# Altium schematic sheet SIX_OUTPORT-V2.SchDoc
size A3
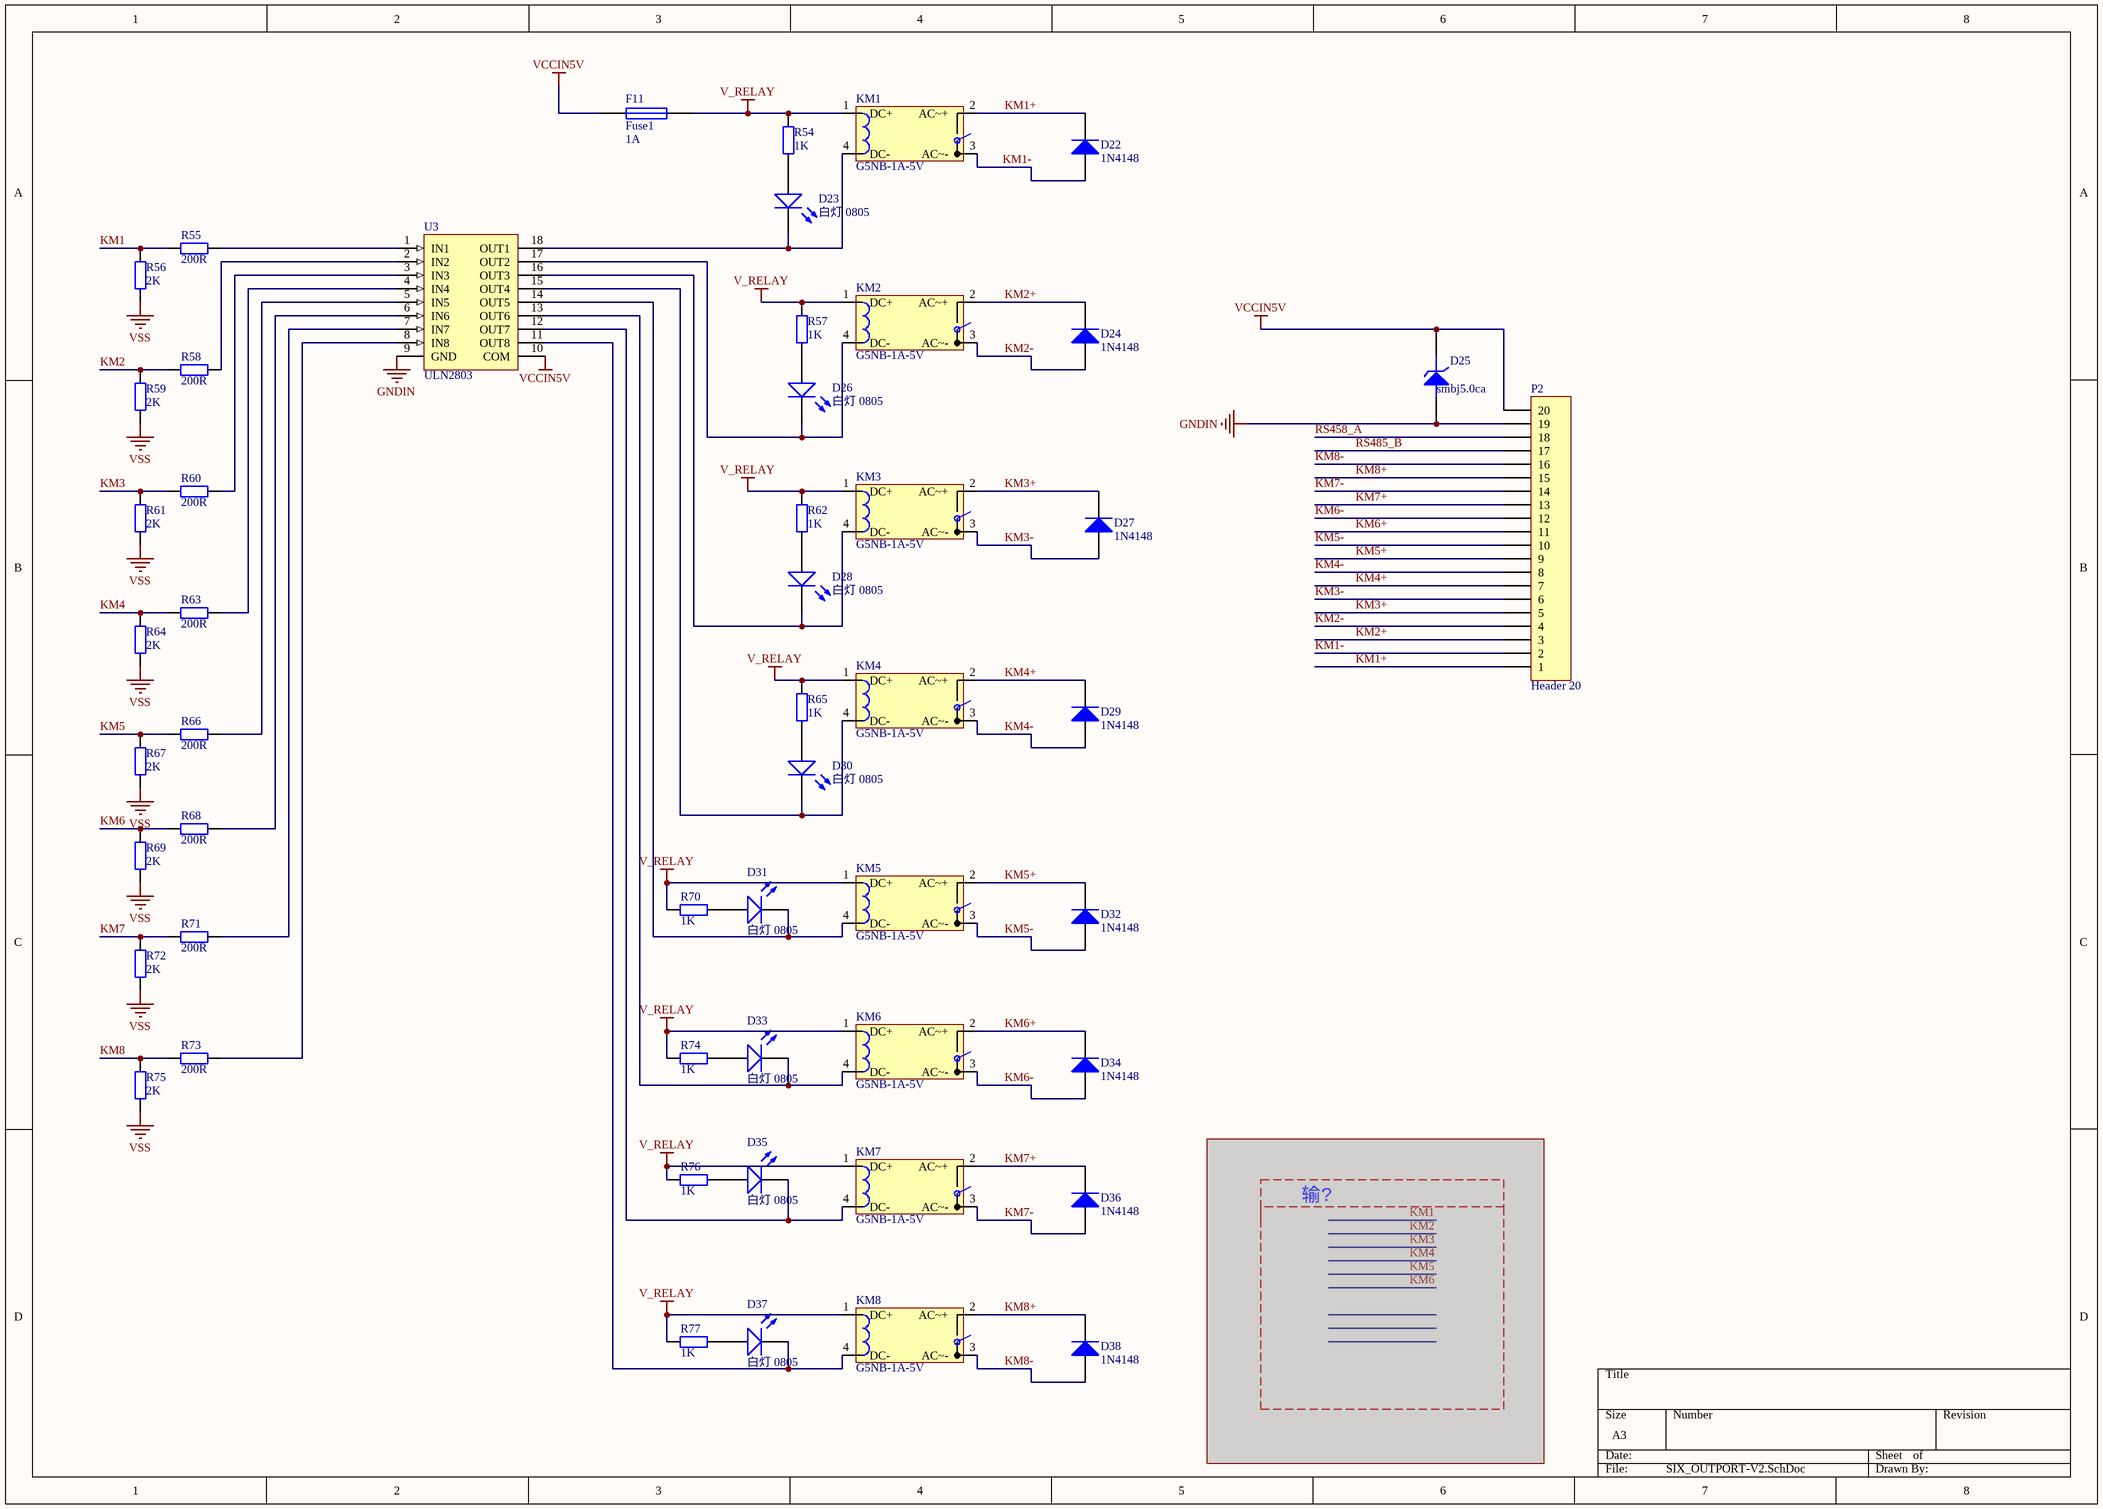
[diagram p0: SIX_OUTPORT-V2.SchDoc]

## Parts
D22  1N4148  [LC-LL-34]
D23  白灯 0805  [LC-0603_LED_S1]
D24  1N4148  [LC-LL-34]
D25  smbj5.0ca  [LC-SMB(DO-214AA)_S1]
D26  白灯 0805  [LC-0603_LED_S1]
D27  1N4148  [LC-LL-34]
D28  白灯 0805  [LC-0603_LED_S1]
D29  1N4148  [LC-LL-34]
D30  白灯 0805  [LC-0603_LED_S1]
D31  白灯 0805  [LC-0603_LED_S1]
D32  1N4148  [LC-LL-34]
D33  白灯 0805  [LC-0603_LED_S1]
D34  1N4148  [LC-LL-34]
D35  白灯 0805  [LC-0603_LED_S1]
D36  1N4148  [LC-LL-34]
D37  白灯 0805  [LC-0603_LED_S1]
D38  1N4148  [LC-LL-34]
F11  Fuse1  value 1A  [LC-1206_R]
KM1  G5NB-1A-5V  [G5NB-1A-5V]
KM2  G5NB-1A-5V  [G5NB-1A-5V]
KM3  G5NB-1A-5V  [G5NB-1A-5V]
KM4  G5NB-1A-5V  [G5NB-1A-5V]
KM5  G5NB-1A-5V  [G5NB-1A-5V]
KM6  G5NB-1A-5V  [G5NB-1A-5V]
KM7  G5NB-1A-5V  [G5NB-1A-5V]
KM8  G5NB-1A-5V  [G5NB-1A-5V]
P2  Header 20  [HDR_5.0_20P]
R54  1K  [LC-0603_R]
R55  200R  [LC-0603_R]
R56  2K  [LC-0603_R]
R57  1K  [LC-0603_R]
R58  200R  [LC-0603_R]
R59  2K  [LC-0603_R]
R60  200R  [LC-0603_R]
R61  2K  [LC-0603_R]
R62  1K  [LC-0603_R]
R63  200R  [LC-0603_R]
R64  2K  [LC-0603_R]
R65  1K  [LC-0603_R]
R66  200R  [LC-0603_R]
R67  2K  [LC-0603_R]
R68  200R  [LC-0603_R]
R69  2K  [LC-0603_R]
R70  1K  [LC-0603_R]
R71  200R  [LC-0603_R]
R72  2K  [LC-0603_R]
R73  200R  [LC-0603_R]
R74  1K  [LC-0603_R]
R75  2K  [LC-0603_R]
R76  1K  [LC-0603_R]
R77  1K  [LC-0603_R]
U3  ULN2803  [LC-SOIC-18_300mil]

## Nets
GNDIN: D25.1(A) P2.19 U3.9(GND)
V_RELAY: F11.2 KM1.1(DC+) KM2.1(DC+) KM3.1(DC+) KM4.1(DC+) KM5.1(DC+) KM6.1(DC+) KM7.1(DC+) KM8.1(DC+) R54.1 R57.1 R62.1 R65.1 R70.1 R74.1 R76.1 R77.1
VCCIN5V: D25.2(K) F11.1 P2.20 U3.10(COM)
VSS: R56.2 R59.2 R61.2 R64.2 R67.2 R69.2 R72.2 R75.2
KM1: R55.2 R56.1
KM1+: D22.2(K) KM1.2(AC~+) P2.1
KM1-: D22.1(A) KM1.3(AC~-) P2.2
KM2: R58.2 R59.1
KM2+: D24.2(K) KM2.2(AC~+) P2.3
KM2-: D24.1(A) KM2.3(AC~-) P2.4
KM3: R60.2 R61.1
KM3+: D27.2(K) KM3.2(AC~+) P2.5
KM3-: D27.1(A) KM3.3(AC~-) P2.6
KM4: R63.2 R64.1
KM4+: D29.2(K) KM4.2(AC~+) P2.7
KM4-: D29.1(A) KM4.3(AC~-) P2.8
KM5: R66.2 R67.1
KM5+: D32.2(K) KM5.2(AC~+) P2.9
KM5-: D32.1(A) KM5.3(AC~-) P2.10
KM6: R68.2 R69.1
KM6+: D34.2(K) KM6.2(AC~+) P2.11
KM6-: D34.1(A) KM6.3(AC~-) P2.12
KM7: R71.2 R72.1
KM7+: D36.2(K) KM7.2(AC~+) P2.13
KM7-: D36.1(A) KM7.3(AC~-) P2.14
KM8: R73.2 R75.1
KM8+: D38.2(K) KM8.2(AC~+) P2.15
KM8-: D38.1(A) KM8.3(AC~-) P2.16
RS458_A: P2.18
RS485_B: P2.17
NetD23_A: D23.A R54.2
NetD23_K: D23.K KM1.4(DC-) U3.18(OUT1)
NetD26_A: D26.A R57.2
NetD26_K: D26.K KM2.4(DC-) U3.17(OUT2)
NetD28_A: D28.A R62.2
NetD28_K: D28.K KM3.4(DC-) U3.16(OUT3)
NetD30_A: D30.A R65.2
NetD30_K: D30.K KM4.4(DC-) U3.15(OUT4)
NetD31_A: D31.A R70.2
NetD31_K: D31.K KM5.4(DC-) U3.14(OUT5)
NetD33_A: D33.A R74.2
NetD33_K: D33.K KM6.4(DC-) U3.13(OUT6)
NetD35_A: D35.A R76.2
NetD35_K: D35.K KM7.4(DC-) U3.12(OUT7)
NetD37_A: D37.A R77.2
NetD37_K: D37.K KM8.4(DC-) U3.11(OUT8)
NetR55_1: R55.1 U3.1(IN1)
NetR58_1: R58.1 U3.2(IN2)
NetR60_1: R60.1 U3.3(IN3)
NetR63_1: R63.1 U3.4(IN4)
NetR66_1: R66.1 U3.5(IN5)
NetR68_1: R68.1 U3.6(IN6)
NetR71_1: R71.1 U3.7(IN7)
NetR73_1: R73.1 U3.8(IN8)

## Notes on the sheet
- 输?

## Library data of the parts
D22 D24 D27 D29 D32 D34 D36 D38 = Diode: Default Diode; Published: 8-Jun-2000; LatestRevisionDate: 17-Jul-2002; LatestRevisionNote: Re-released for DXP Platform.; PackageDocument: Sep-1996; PackageReference: SMC; Publisher: Altium Limited; Code_JEDEC: DO-214-AB
D23 D26 D28 D30 D31 D33 D35 D37 = 0805 白灯: 发光二极管; ComponentLink1Description: 供应商链接; ComponentLink1URL: http://www.szlcsc.com/product/details_35468.html; Package: 0805; Supplier: LC; SuppliersPartNumber: C34499
D25 = ZENER3: Zener Diode
F11 = Fuse1: 保险丝
P2 = Header 20: Header, 20-Pin; LatestRevisionDate: 17-Jul-2002; LatestRevisionNote: Re-released for DXP Platform.; Publisher: Altium Limited
R54 R57 R62 R65 R70 R74 R76 R77 = Res2: Resistor; Published: 8-Jun-2000; LatestRevisionDate: 17-Jul-2002; LatestRevisionNote: Re-released for DXP Platform.; PackageReference: AXIAL-0.4; Publisher: Altium Limited; Value: 1K
R55 R56 R58-R61 R63 R64 R66-R69 R71-R73 R75 = Res2: Resistor; Value: 1K; Published: 8-Jun-2000; LatestRevisionDate: 17-Jul-2002; LatestRevisionNote: Re-released for DXP Platform.; PackageReference: AXIAL-0.4; Publisher: Altium Limited